# Altium schematic sheet PD_IO.SchDoc
size A; SheetNumber: 2; SheetTotal: 2
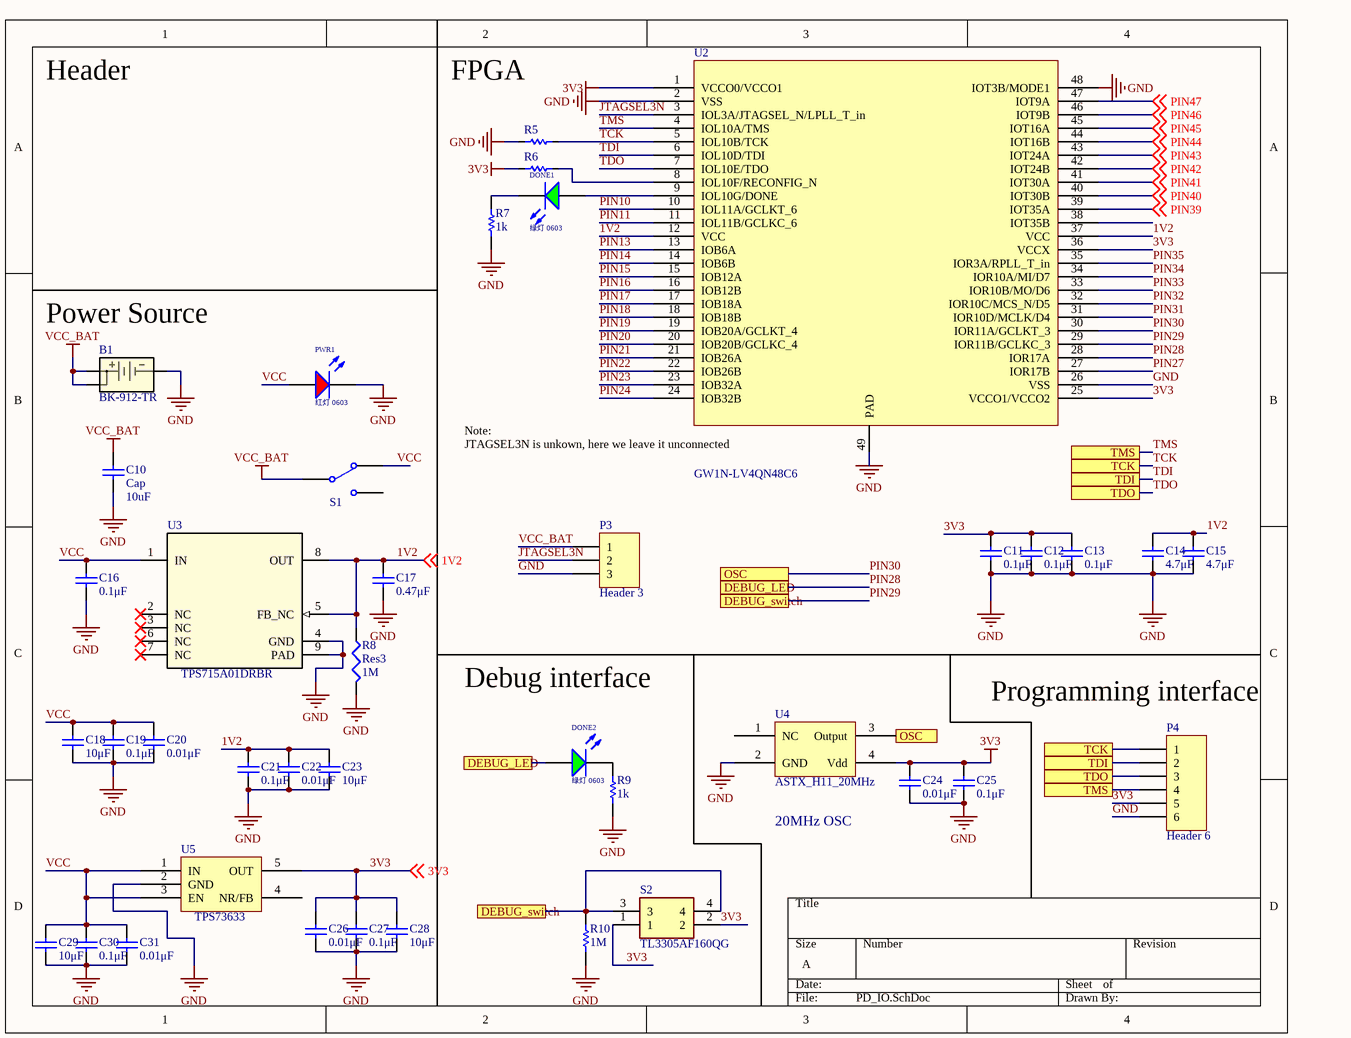
[diagram p0: PD_IO.SchDoc]

## Parts
B1  BK-912-TR  [MPD_BK-912-TR]
C10  Cap  value 10uF  [1608[0603]]
C11  0.1μF  [1608[0603]]
C12  0.1μF  [1608[0603]]
C13  0.1μF  [1608[0603]]
C14  4.7μF  [1608[0603]]
C15  4.7μF  [1608[0603]]
C16  0.1μF  [1608[0603]]
C17  0.47μF  [1608[0603]]
C18  10μF  [1608[0603]]
C19  0.1μF  [1608[0603]]
C20  0.01μF  [1608[0603]]
C21  0.1μF  [1608[0603]]
C22  0.01μF  [1608[0603]]
C23  10μF  [1608[0603]]
C24  0.01μF  [1608[0603]]
C25  0.1μF  [1608[0603]]
C26  0.01μF  [1608[0603]]
C27  0.1μF  [1608[0603]]
C28  10μF  [1608[0603]]
C29  10μF  [1608[0603]]
C30  0.1μF  [1608[0603]]
C31  0.01μF  [1608[0603]]
DONE1  绿灯 0603  [0603_LED]
DONE2  绿灯 0603  [0603_LED]
P3  Header 3  [HDR1X3]
P4  Header 6  [HDR1X6]
PWR1  红灯 0603  [0603_LED]
R5  4.7k  [1608[0603]]  (value not drawn)
R6  4.7k  [1608[0603]]  (value not drawn)
R7  value 1k  [1608[0603]]  (hidden comment: 1k Ohm)
R8  Res3  value 1M  [J1-0603]
R9  value 1k  [1608[0603]]  (hidden comment: 1k Ohm)
R10  value 1M  [1608[0603]]  (hidden comment: 1k Ohm)
S1  SW-SPDT  [SW_SPDT]  (value not drawn)
S2  TL3305AF160QG  [TL3305AF160QG]
U2  GW1N-LV4QN48C6  [QFN40P600X600X60_HS-49N]
U3  TPS715A01DRBR  [DRB0008A]
U4  ASTX_H11_20MHz  [ASTXH1124576MHZT]
U5  TPS73633  [TPS73633]

## Ports
DEBUG_LED, DEBUG_switch, OSC, TCK, TDI, TDO, TMS

## Nets
3V3: C11.2 C12.2 C13.2 C24.2 C25.2 C26.2 C27.2 C28.2 P4.5 R6.1 S2.1 S2.2 U2.1(VCCO0/VCCO1) U2.25(VCCO1/VCCO2) U2.36(VCCX) U4.4(Vdd) U5.5(OUT) ; off-sheet 3V3
GND: B1.3 C10.1 C11.1 C12.1 C13.1 C14.1 C15.1 C16.1 C17.1 C18.1 C19.1 C20.1 C21.1 C22.1 C23.1 C24.1 C25.1 C26.1 C27.1 C28.1 C29.1 C30.1 C31.1 P3.3 P4.6 PWR1.K R5.1 R7.1 R8.2 R9.1 R10.1 U2.2(VSS) U2.26(VSS) U2.48(IOT3B/MODE1) U2.49(PAD) U3.4(GND) U3.9(PAD) U4.2(GND) U5.2(GND)
VCC_BAT: B1.1 B1.2 C10.2 P3.1 S1.2
1V2: C14.2 C15.2 C17.2 C21.2 C22.2 C23.2 R8.1 U2.12(VCC) U2.37(VCC) U3.5(FB_NC) U3.8(OUT) ; off-sheet 1V2
JTAGSEL3N: P3.2 U2.3(IOL3A/JTAGSEL_N/LPLL_T_in)
PIN10: U2.10(IOL11A/GCLKT_6)
PIN11: U2.11(IOL11B/GCLKC_6)
PIN13: U2.13(IOB6A)
PIN14: U2.14(IOB6B)
PIN15: U2.15(IOB12A)
PIN16: U2.16(IOB12B)
PIN17: U2.17(IOB18A)
PIN18: U2.18(IOB18B)
PIN19: U2.19(IOB20A/GCLKT_4)
PIN20: U2.20(IOB20B/GCLKC_4)
PIN21: U2.21(IOB26A)
PIN22: U2.22(IOB26B)
PIN23: U2.23(IOB32A)
PIN24: U2.24(IOB32B)
PIN27: U2.27(IOR17B)
PIN28: DONE2.A U2.28(IOR17A) ; port DEBUG_LED
PIN29: R10.2 S2.3 S2.4 U2.29(IOR11B/GCLKC_3) ; port DEBUG_switch
PIN30: U2.30(IOR11A/GCLKT_3) U4.3(Output) ; port OSC
PIN31: U2.31(IOR10D/MCLK/D4)
PIN32: U2.32(IOR10C/MCS_N/D5)
PIN33: U2.33(IOR10B/MO/D6)
PIN34: U2.34(IOR10A/MI/D7)
PIN35: U2.35(IOR3A/RPLL_T_in)
PIN39: U2.39(IOT35A) ; off-sheet PIN39
PIN40: U2.40(IOT30B) ; off-sheet PIN40
PIN41: U2.41(IOT30A) ; off-sheet PIN41
PIN42: U2.42(IOT24B) ; off-sheet PIN42
PIN43: U2.43(IOT24A) ; off-sheet PIN43
PIN44: U2.44(IOT16B) ; off-sheet PIN44
PIN45: U2.45(IOT16A) ; off-sheet PIN45
PIN46: U2.46(IOT9B) ; off-sheet PIN46
PIN47: U2.47(IOT9A) ; off-sheet PIN47
TCK: P4.1 R5.2 U2.5(IOL10B/TCK) ; port TCK
TDI: P4.2 U2.6(IOL10D/TDI) ; port TDI
TDO: P4.3 U2.7(IOL10E/TDO) ; port TDO
TMS: P4.4 U2.4(IOL10A/TMS) ; port TMS
VCC: C16.2 C18.2 C19.2 C20.2 C29.2 C30.2 C31.2 PWR1.A S1.3 U3.1(IN) U5.1(IN) U5.3(EN)
NetDONE1_A: DONE1.A U2.9(IOL10G/DONE)
NetDONE1_K: DONE1.K R7.2
NetDONE2_K: DONE2.K R9.2
NetR6_2: R6.2 U2.8(IOL10F/RECONFIG_N)

Not connected (* = marked no-connect by the designer): S1 1; U2 38(IOT35B); U3 2(NC)* 3(NC)* 6(NC)* 7(NC)*; U4 1(NC); U5 4(NR/FB)

## Notes on the sheet
- Header
- FPGA
- (near B1) Power Source
- (near U2) JTAGSEL3N is unkown, here we leave it unconnected
- Note:
- Debug interface
- (near P4) Programming interface
- 20MHz OSC

## Library data of the parts
B1 = BK-912-TR: No Description Available; Vendor: Memory Protection Devices, Inc; Built_By: EMA_Cory; SourceLibrary: Memory_Protection_Devices_2020-01-22; VALUE_2: Value; Datasheet: https://www.memoryprotectiondevices.com/datasheets/BK-912-datasheet.pdf; Manufacturer_Part_Number: BK-912-TR; Copyright: Copyright (C) 2018 Accelerated Designs. All rights reserved; RefDes: RefDes; Type: DEV
C10 = Cap: Capacitor; Published: 8-Jun-2000; LatestRevisionDate: 17-Jul-2002; LatestRevisionNote: Re-released for DXP Platform.; PackageReference: RAD-0.3; Publisher: Altium Limited; PackageDescription: Radial Cap, Thru-Hole; 2 Leads; 0.3 in Pin Spacing
C11-C17 C19 C21 C25 C27 C30 = CAP_2: MLCCs; Value: 100pF; Published: 8-Jun-2000; LatestRevisionDate: 17-Jul-2002; LatestRevisionNote: Re-released for DXP Platform.; PackageReference: RAD-0.3; Publisher: Altium Limited; PackageDescription: Radial Cap, Thru-Hole; 2 Leads; 0.3 in Pin Spacing
C18 C23 C28 C29 = CAP_4: MLCCs; Value: 100pF; Published: 8-Jun-2000; LatestRevisionDate: 17-Jul-2002; LatestRevisionNote: Re-released for DXP Platform.; PackageReference: RAD-0.3; Publisher: Altium Limited; PackageDescription: Radial Cap, Thru-Hole; 2 Leads; 0.3 in Pin Spacing
C20 C22 C24 C26 C31 = CAP_3: MLCCs; Value: 100pF; Published: 8-Jun-2000; LatestRevisionDate: 17-Jul-2002; LatestRevisionNote: Re-released for DXP Platform.; PackageReference: RAD-0.3; Publisher: Altium Limited; PackageDescription: Radial Cap, Thru-Hole; 2 Leads; 0.3 in Pin Spacing
DONE1 DONE2 = 0603 绿灯: 发光二极管; ComponentLink1Description: 供应商链接; ComponentLink1URL: http://www.szlcsc.com/product/details_73152.html; Package: 0603; Supplier: LC; SuppliersPartNumber: C72043
P3 = Header 3: Header, 3-Pin; LatestRevisionDate: 17-Jul-2002; LatestRevisionNote: Re-released for DXP Platform.; Publisher: Altium Limited
P4 = Header 6: Header, 6-Pin; LatestRevisionDate: 17-Jul-2002; LatestRevisionNote: Re-released for DXP Platform.; Publisher: Altium Limited
PWR1 = 0603 红灯: 发光二极管; ComponentLink1Description: 供应商链接; ComponentLink1URL: http://www.szlcsc.com/product/details_2659.html; Package: 0603; Supplier: LC; SuppliersPartNumber: C2286
R5 R6 = RES_1: Resistor; Value: 1K; Published: 8-Jun-2000; LatestRevisionDate: 17-Jul-2002; LatestRevisionNote: Re-released for DXP Platform.; PackageReference: AXIAL-0.3; Publisher: Altium Limited; PackageDescription: Axial Device, Thru-Hole; 2 Leads; 0.3 in Pin Spacing
R7 R9 R10 = Res: Chip Resistor (Surface Mount); Manufacturer: Generic Chip Res (TBD); Manufacturer Part Number: *; Digi-Key Part Number: *; Rating: *
R8 = Res3: Resistor; Published: 8-Jun-2000; LatestRevisionDate: 29-May-2009; LatestRevisionNote: IPC-7351 Footprint Added.; PackageReference: J1-0603; Publisher: Altium Limited; PackageDescription: Chip Resistor
S1 = SW-SPDT: Single Pole Double Throw Subminiature Toggle Switch, Right Angle Mounting, Vertical Actuation; Published: 24-Mar-1999; LatestRevisionDate: 17-Dec-2003; LatestRevisionNote: Schematic revised, PCB Footprint replaced.; DatasheetDocument: 05-Dec-2000; PackageReference: TL36WW15050; Publisher: Altium Limited; ComponentLink1Description: Manufacturer Link; ComponentLink1URL: http://www.apem.com
S2 = TL3305AF160QG: Switch; Manufacturer_Name: E-Switch; Datasheet Link: https://componentsearchengine.com//TL3305AF160QG.pdf; Mouser2 Part Number: 612-TL3305AF160QG; Mouser2 Price/Stock: https://www.mouser.com/Search/Refine.aspx?Keyword=612-TL3305AF160QG; Manufacturer_Part_Number: TL3305AF160QG
U3 = TPS715A01DRBR: No Description Available; Mfr_Name: Texas Instruments; Alternate_PartNumber: TPS715A01DRBT; CompType: IC; Type: DEV; RefDes: RefDes; Copyright: Copyright (C) 2021 Ultra Librarian. All rights reserved.; Manufacturer_Part_Number: TPS715A01DRBR; Application_BuildNumber: *; PartNumber: TPS715A01DRBR; PackageReference: DRB0008A; MountType: SMT; RoHS: Y; Manufacturer: Texas Instruments